# Altium schematic sheet drive_circuit.SchDoc
size 449 x 299 mm; SheetNumber: 2; SheetTotal: 2
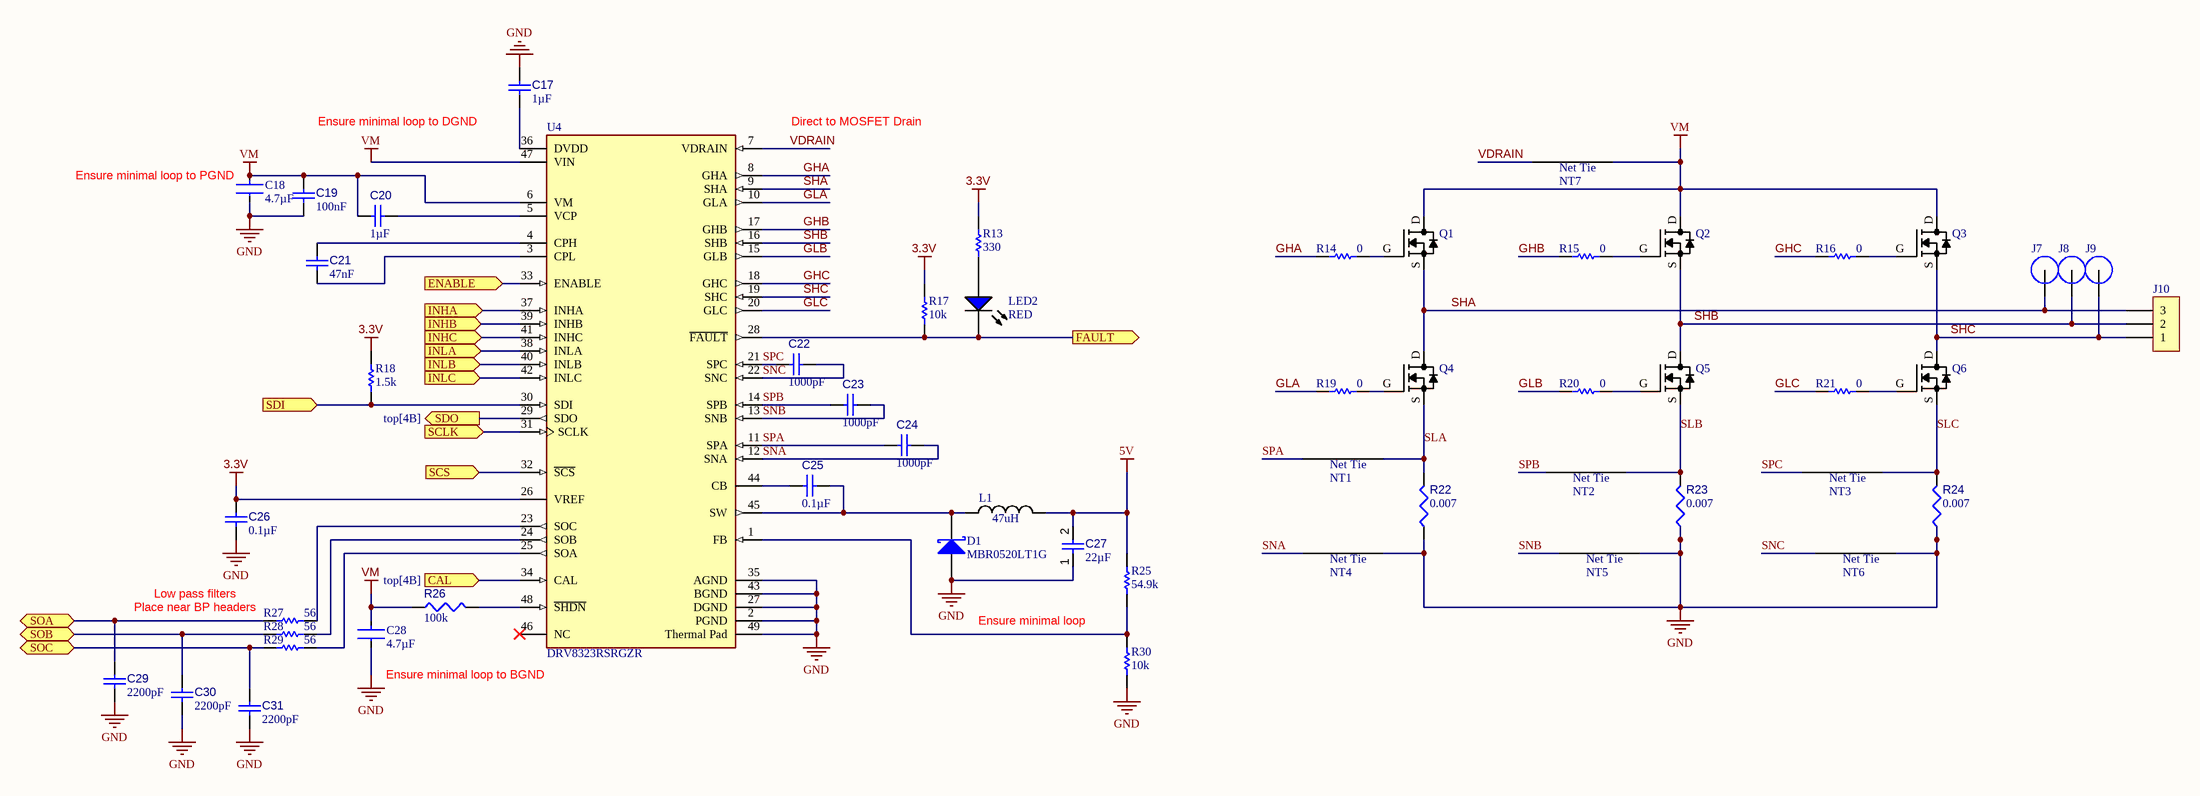
[diagram p0: drive_circuit.SchDoc]

## Parts
C17  value 1µF  [CAPC1608X94X35NL15T15]  (hidden comment: Capacitor 1 uF +/- 10% 16 V 0603)
C18  value 4.7µF  [FP-MK325N-MFG]  (hidden comment: HMK325B7225KN-T)
C19  value 100nF  [CAPC0603(1608)100_L]  (hidden comment: Capacitor 4.7µF +/-20% 10V 0603)
C20  value 1µF  [CAPC1608X94X35NL15T15]  (hidden comment: Capacitor 1 uF +/- 10% 16 V 0603)
C21  value 47nF  [CAPC0603(1608)100_L]  (hidden comment: Capacitor 4.7µF +/-20% 10V 0603)
C22  value 1000pF  [CAPC1608X94X35NL15T15]  (hidden comment: Capacitor 1 uF +/- 10% 16 V 0603)
C23  value 1000pF  [CAPC1608X94X35NL15T15]  (hidden comment: Capacitor 1 uF +/- 10% 16 V 0603)
C24  value 1000pF  [CAPC1608X94X35NL15T15]  (hidden comment: Capacitor 1 uF +/- 10% 16 V 0603)
C25  value 0.1µF  [CAPC1608X94X35NL15T15]  (hidden comment: Capacitor 1 uF +/- 10% 16 V 0603)
C26  value 0.1µF  [CAPC1608X94X35NL15T15]  (hidden comment: Capacitor 1 uF +/- 10% 16 V 0603)
C27  value 22µF  [CAPC3216X180X50NL20T25]  (hidden comment: Capacitor 10 uF +/- 10% 16 V 1206)
C28  value 4.7µF  [FP-MK325N-MFG]  (hidden comment: HMK325B7225KN-T)
C29  value 2200pF  [CAPC1608X94X35NL15T15]  (hidden comment: Capacitor 1 uF +/- 10% 16 V 0603)
C30  value 2200pF  [CAPC1608X94X35NL15T15]  (hidden comment: Capacitor 1 uF +/- 10% 16 V 0603)
C31  value 2200pF  [CAPC1608X94X35NL15T15]  (hidden comment: Capacitor 1 uF +/- 10% 16 V 0603)
D1  MBR0520LT1G  [ONSC-SOD-123-2-425-04_V]
J7  (no value)  [M3 Spade Hole]
J8  (no value)  [M3 Spade Hole]
J9  (no value)  [M3 Spade Hole]
J10  1704936  [1704936]  (value not drawn)
L1  value 47uH  [INDC6060X28N]  (hidden comment: 22uH)
LED2  RED  [VISH-TLMX1100-2_V]
NT1  0.25mm  [NetTie_0.25mm]  (value not drawn)  (net tie, no BOM)
NT2  0.25mm  [NetTie_0.25mm]  (value not drawn)  (net tie, no BOM)
NT3  0.25mm  [NetTie_0.25mm]  (value not drawn)  (net tie, no BOM)
NT4  0.25mm  [NetTie_0.25mm]  (value not drawn)  (net tie, no BOM)
NT5  0.25mm  [NetTie_0.25mm]  (value not drawn)  (net tie, no BOM)
NT6  0.25mm  [NetTie_0.25mm]  (value not drawn)  (net tie, no BOM)
NT7  0.25mm  [NetTie_0.25mm]  (value not drawn)  (net tie, no BOM)
Q1  (no value)  [SO8FL]
Q2  (no value)  [SO8FL]
Q3  (no value)  [SO8FL]
Q4  (no value)  [SO8FL]
Q5  (no value)  [SO8FL]
Q6  (no value)  [SO8FL]
R13  value 330  [RESC1608X55X25ML10T15]  (hidden comment: Resistor 0R +/- 5% 0603 100 mW)
R14  value 0  [RESC1608X55X25ML10T15]  (hidden comment: Resistor 0R +/- 5% 0603 100 mW)
R15  value 0  [RESC1608X55X25ML10T15]  (hidden comment: Resistor 0R +/- 5% 0603 100 mW)
R16  value 0  [RESC1608X55X25ML10T15]  (hidden comment: Resistor 0R +/- 5% 0603 100 mW)
R17  value 10k  [RESC1608X55X25ML10T15]  (hidden comment: Resistor 0R +/- 5% 0603 100 mW)
R18  value 1.5k  [RESC1608X55X25ML10T15]  (hidden comment: Resistor 0R +/- 5% 0603 100 mW)
R19  value 0  [RESC1608X55X25ML10T15]  (hidden comment: Resistor 0R +/- 5% 0603 100 mW)
R20  value 0  [RESC1608X55X25ML10T15]  (hidden comment: Resistor 0R +/- 5% 0603 100 mW)
R21  value 0  [RESC1608X55X25ML10T15]  (hidden comment: Resistor 0R +/- 5% 0603 100 mW)
R22  value 0.007  [FP-RT2512-MFG]  (hidden comment: RT2512BKD071K21L)
R23  value 0.007  [FP-RT2512-MFG]  (hidden comment: RT2512BKD071K21L)
R24  value 0.007  [FP-RT2512-MFG]  (hidden comment: RT2512BKD071K21L)
R25  value 54.9k  [RESC1608X55X25ML10T15]  (hidden comment: Resistor 0R +/- 5% 0603 100 mW)
R26  value 100k  [RESC1608X55X25ML10T15]  (hidden comment: Resistor 100k +/-1% 0603 100 mW)
R27  value 56  [RESC1608X55X25ML10T15]  (hidden comment: Resistor 0R +/- 5% 0603 100 mW)
R28  value 56  [RESC1608X55X25ML10T15]  (hidden comment: Resistor 0R +/- 5% 0603 100 mW)
R29  value 56  [RESC1608X55X25ML10T15]  (hidden comment: Resistor 0R +/- 5% 0603 100 mW)
R30  value 10k  [RESC1608X55X25ML10T15]  (hidden comment: Resistor 0R +/- 5% 0603 100 mW)
U4  DRV8323RSRGZR  [FP-RGZ0048A-IPC_A]

## Ports
CAL (in, see top[4B]), ENABLE (in, see top[4B]), FAULT (out, see top[5B]), INHA (in, see top[4B]), INHB (in, see top[4B]), INHC (in, see top[4B]), INLA (in, see top[4B]), INLB (in, see top[4B]), INLC (in, see top[4B]), SCLK (in, see top[4B]), SCS (in, see top[4B]), SDI (in, see top[4B]), SDO (out, see top[4B]), SOA (bidir, see top[5B]), SOB (bidir, see top[5B]), SOC (bidir, see top[5B])

## Nets
3.3V: C26.2 R13.2 R17.2 R18.2 U4.26(VREF)
5V: C27.2 L1.2 R25.2
GND: C17.2 C18.2 C19.1 C26.1 C27.1 C28.2 C29.1 C30.1 C31.1 D1.1(A) NT4.2 NT5.2 NT6.2 R22.1 R23.1 R24.1 R30.1 U4.2(PGND) U4.27(DGND) U4.35(AGND) U4.43(BGND) U4.49(Thermal_Pad)
VM: C18.1 C19.2 C20.1 C28.1 NT7.2 Q1.D Q2.D Q3.D R26.1 U4.6(VM) U4.47(VIN)
CAL: U4.34(CAL) ; port CAL
ENABLE: U4.33(ENABLE) ; port ENABLE
FAULT: LED2.2(K) R17.1 U4.28(~{FAULT}) ; port FAULT
GHA: R14.2 U4.8(GHA)
GHB: R15.2 U4.17(GHB)
GHC: R16.2 U4.18(GHC)
GLA: R19.2 U4.10(GLA)
GLB: R20.2 U4.15(GLB)
GLC: R21.2 U4.20(GLC)
INHA: U4.37(INHA) ; port INHA
INHB: U4.39(INHB) ; port INHB
INHC: U4.41(INHC) ; port INHC
INLA: U4.38(INLA) ; port INLA
INLB: U4.40(INLB) ; port INLB
INLC: U4.42(INLC) ; port INLC
SCLK: U4.31(SCLK) ; port SCLK
SCS: U4.32(~{SCS}) ; port SCS
SDI: R18.1 U4.30(SDI) ; port SDI
SDO: U4.29(SDO) ; port SDO
SHA: J7.1 J10.3 Q1.S Q4.D U4.9(SHA)
SHB: J8.1 J10.2 Q2.S Q5.D U4.16(SHB)
SHC: J9.1 J10.1 Q3.S Q6.D U4.19(SHC)
SLA: NT1.2 Q4.S R22.2
SLB: NT2.2 Q5.S R23.2
SLC: NT3.2 Q6.S R24.2
SNA: C24.1 NT4.1 U4.12(SNA)
SNB: C23.1 NT5.1 U4.13(SNB)
SNC: C22.1 NT6.1 U4.22(SNC)
SOA: C29.2 R27.2 ; port SOA
SOB: C30.2 R28.2 ; port SOB
SOC: C31.2 R29.2 ; port SOC
SPA: C24.2 NT1.1 U4.11(SPA)
SPB: C23.2 NT2.1 U4.14(SPB)
SPC: C22.2 NT3.1 U4.21(SPC)
VDRAIN: NT7.1 U4.7(VDRAIN)
NetC17_1: C17.1 U4.36(DVDD)
NetC20_2: C20.2 U4.5(VCP)
NetC21_1: C21.1 U4.4(CPH)
NetC21_2: C21.2 U4.3(CPL)
NetC25_1: C25.1 D1.2(K) L1.1 U4.45(SW)
NetC25_2: C25.2 U4.44(CB)
NetLED2_1: LED2.1(A) R13.1
NetQ1_G: Q1.G R14.1
NetQ2_G: Q2.G R15.1
NetQ3_G: Q3.G R16.1
NetQ4_G: Q4.G R19.1
NetQ5_G: Q5.G R20.1
NetQ6_G: Q6.G R21.1
NetR25_1: R25.1 R30.2 U4.1(FB)
NetR26_2: R26.2 U4.48(~{SHDN})
NetR27_1: R27.1 U4.23(SOC)
NetR28_1: R28.1 U4.24(SOB)
NetR29_1: R29.1 U4.25(SOA)

Not connected (* = marked no-connect by the designer): U4 46(NC)*

## Notes on the sheet
- Ensure minimal loop to DGND
- Direct to MOSFET Drain
- (near C18) Ensure minimal loop to PGND
- Low pass filters
- Place near BP headers
- Ensure minimal loop
- Ensure minimal loop to BGND
- (in symbol NetTie_0.25mm) Net Tie

## Library data of the parts
C17 = CMP-001-00003-6: Chip Capacitor, 1 uF, +/- 10%, 6.3 V, 0603 (1608 Metric); Voltage Rating: 16V; Capacitor Type: Ceramic; Max Operating Temperature: 125°C; Pins: 2; Tolerance: 10%; Min Operating Temperature: -55°C; RoHS Compliant: True; Mounting Technology: SM; Case/Package: 0603
C18 C28 = CMP-001-00088-1: Ceramic Capacitor, Multilayer, Ceramic, 100V, 10% +Tol, 10% -Tol, X7R, 15% TC, 2.2uF, Surface Mount, 1210; Capacitor Type: Ceramic; Min Operating Temperature: -55°C; Pins: 2; Case/Package: 1210; Mounting Technology: Surface Mount; Max Operating Temperature: 125°C; RoHS Compliant: Yes
C19 = CMP-001-00076-4: Chip Capacitor, 4.7µF +/-20%, 100V, 0603, Thickness 1 mm; Tolerance: 10%; Mounting Technology: SMT; Case/Package: 0603; Pins: 2; Min Operating Temperature: -55°C; Max Operating Temperature: 85°C; Voltage Rating: 10V
C20 = CMP-001-00003-6: Chip Capacitor, 1 uF, +/- 10%, 16 V, 0603 (1608 Metric); Voltage Rating: 16V; Capacitor Type: Ceramic; Max Operating Temperature: 125°C; Pins: 2; Tolerance: 10%; Min Operating Temperature: -55°C; RoHS Compliant: True; Mounting Technology: SM; Case/Package: 0603
C21 = CMP-001-00076-4: Chip Capacitor, 47nF +/-20%, 100V, 0603, Thickness 1 mm; Tolerance: 10%; Mounting Technology: SMT; Case/Package: 0603; Pins: 2; Min Operating Temperature: -55°C; Max Operating Temperature: 85°C; Voltage Rating: 10V
C22-C26 C29-C31 = CMP-001-00003-6: Chip Capacitor, 0.1uF, +/- 10%, 6.3 V, 0603 (1608 Metric); Voltage Rating: 16V; Capacitor Type: Ceramic; Max Operating Temperature: 125°C; Pins: 2; Tolerance: 10%; Min Operating Temperature: -55°C; RoHS Compliant: True; Mounting Technology: SM; Case/Package: 0603
C27 = CMP-001-00016-6: Chip Capacitor, 22 uF, +/- 10%, 16 V, 1206 (3216 Metric); Capacitor Type: Ceramic; Voltage Rating: 16V; Tolerance: 10%; Min Operating Temperature: -55°C; Pins: 2; Mounting Technology: SM; Case/Package: 1206; Max Operating Temperature: 125°C; RoHS Compliant: True
D1 = CMP-004-00003-2: Schottky Power Rectifier, 20 V, 5.5 A, -65 to 125 degC, 2-Pin SMD, RoHS, Tape and Reel; Manufacturer: ON Semiconductor; Forward Current: 500mA; Peak Reverse Current: 250uA; Elements: 1; Forward Voltage: 385mV; Max Surge Current: 5.5A; Max Operating Temperature: 125°C; Min Operating Temperature: -65°C; Mounting Technology: SM; Datasheet URL: http://www.onsemi.cn/pub_link/Collateral/MBR0520LT1-D.PDF; RoHS Compliant: True; Pins: 2; Package Quantity: 3000; Case/Package: SOD; Package Reference: SOD-123-2-425-04; Package Description: 2-Pin Surface Mount Device, Body 2.69 x 1.6 mm; Packaging: TapeandReel; Manufacturer URL: http://www.onsemi.com/; Datasheet Version: Rev. 6, 01/2012
J7-J9 = M3 Spade Terminal
J10 = 1704936: CONN TERM BLOCK 3POS 7.62MM; Manufacturer: Phoenix Contact; Number of Levels: 1; Positions Per Level: 3; Pitch: 0.300" (7.62mm); Mating Orientation: Horizontal with Board; Current: 30A; Voltage: 300V; Wire Gauge: 10-30 AWG; Wire Termination: Screw - Rising Cage Clamp; Torque - Screw: 0.5-0.6 Nm (4.4-5.3 Lb-In); Screw Thread: M3; Supplier 1: Digi-Key; Supplier Part Number 1: 277-5954-ND; RoHS: RoHS Compliant; Category: Connectors, Interconnects; Stock: 3559; Pricing 1: 1=2.19, 10=2.128, 50=1.989, 100=1.8299, 250=1.69064, 500=1.61108, 1000=1.482 (USD); Packaging: Bulk; Part Status: Active; Mounting Type: Through Hole; Features: Interlocking (Side); Color: Green; Operating Temperature: -; Housing Material: Polyamide (PA), Nylon; Contact Material - Plating: -; Clamp Material - Plating: -; Screw Material - Plating: -; ComponentLink1URL: http://media.digikey.com/PDF/Data%20Sheets/Phoenix%20Contact%20PDFs/1704936.pdf; ComponentLink1Description: http://media.digikey.com/PDF/Data%20Sheets/Phoenix%20Contact%20PDFs/1704936.pdf; Manufacturer Part Number: 1704936
L1 = NR6028T220M: INDUCTOR 47UH 1.4A 175.5 MOHM
LED2 = CMP-007-00028-2: red LED, 10 mA, 2 V, -40 to 100 degC, 2-Pin SMD (0603), RoHS, Tape and Reel; Manufacturer: Vishay Semiconductor; Forward Voltage: 3.9V; Illumination Colour: Blue; Viewing Angle: 160degrees; Power: 68mW; Forward Current: 10mA; Lens Style: Diffused; Luminous Intensity: 5mcd; Case/Package: 0603; Datasheet URL: http://download.siliconexpert.com/pdfs/2016/8/7/12/43/26/667/vsh_/manual/379263299541529tlmb1100.pdf; Datasheet Version: Rev. 2.7, 03/2016; Manufacturer URL: http://www.vishay.com/; Package Reference: 0603; Min Operating Temperature: -40°C; Packaging: TapeandReel; RoHS Compliant: True; Nominal Vf: 3.9V; Mounting Technology: SM; Pins: 2; Package Description: 2-Pin Surface Mount Device, Body 1.6 x 0.8 mm; Colour: Blue; Package Quantity: 3000; Max Operating Temperature: 100°C
NT1-NT7 = NetTie_0.25mm
Q1-Q6 = NTMFS4935NT1G: MOSFET N-CH 30V 13A SO8FL; Manufacturer: ON Semiconductor; FET Type: N-Channel; Current - Continuous Drain (Id) @ 25°C: 13A (Ta), 93A (Tc); Drive Voltage (Max Rds On,  Min Rds On): 4.5V, 10V; Vgs(th) (Max) @ Id: 2.2V @ 250µA; Gate Charge (Qg) (Max) @ Vgs: 49.4nC @ 10V; Input Capacitance (Ciss) (Max) @ Vds: 4850pF @ 15V; Vgs (Max): ±20V; Power Dissipation (Max): 930mW (Ta), 48W (Tc); Rds On (Max) @ Id, Vgs: 3.2 mOhm @ 30A, 10V; Supplier 1: Digi-Key; Supplier Part Number 1: NTMFS4935NT1GOSCT-ND; RoHS: RoHS Compliant; Category: Discrete Semiconductor Products; Stock 1: 932; Pricing 1: 1=0.61, 10=0.541, 100=0.4145, 500=0.3277 (USD); Packaging: Cut Tape (CT); Part Status: Active; Technology: MOSFET (Metal Oxide); Drain to Source Voltage (Vdss): 30V; FET Feature: -; Operating Temperature: -55°C ~ 150°C (TJ); Mounting Type: Surface Mount; Supplier Device Package: 5-DFN (5x6) (8-SOFL); Package / Case: 8-PowerTDFN, 5 Leads; ComponentLink1URL: http://www.onsemi.com/pub_link/Collateral/NTMFS4935N-D.PDF; ComponentLink1Description: http://www.onsemi.com/pub_link/Collateral/NTMFS4935N-D.PDF; Manufacturer Part Number: NTMFS4935NT1G
R13 = CMP-009-00006-5: Chip Resistor, 330 Ohm, 0.1 W, -55 to 155 degC, 0603 (1608 Metric); Power: 100mW; Voltage Rating: 50V; Max Operating Temperature: 155°C; RoHS Compliant: True; Mounting Technology: SM; Case/Package: 0603; Min Operating Temperature: -55°C; Tolerance: 5%; Pins: 2
R14-R17 R19-R21 R25 R27-R30 = CMP-009-00006-5: Chip Resistor, 10k Ohm, 0.1 W, -55 to 155 degC, 0603 (1608 Metric); Power: 100mW; Voltage Rating: 50V; Max Operating Temperature: 155°C; RoHS Compliant: True; Mounting Technology: SM; Case/Package: 0603; Min Operating Temperature: -55°C; Tolerance: 5%; Pins: 2
R18 = CMP-009-00006-5: Chip Resistor, 1.5k Ohm, 0.1 W, -55 to 155 degC, 0603 (1608 Metric); Power: 100mW; Voltage Rating: 50V; Max Operating Temperature: 155°C; RoHS Compliant: True; Mounting Technology: SM; Case/Package: 0603; Min Operating Temperature: -55°C; Tolerance: 5%; Pins: 2
R22-R24 = CMP-009-00179-1: Fixed Resistor, Thin Film, 0.75W, 1210ohm, 200V, 0.1% +/-Tol, 25ppm/Cel, Surface Mount, 2512; Power: 750mW; Case/Package: 2512; RoHS Compliant: Yes; Mounting Technology: Surface Mount; Max Operating Temperature: 125°C; Pins: 2; Tolerance: 0.1%; Min Operating Temperature: -55°C
R26 = CMP-009-00023-5: Chip Resistor, 100 KOhm, +/- 1%, 0.1 W, -55 to 155 degC, 0603 (1608 Metric); Voltage Rating: 50V; Power: 100mW; Max Operating Temperature: 155°C; RoHS Compliant: True; Tolerance: 1%; Pins: 2; Case/Package: 0603; Mounting Technology: SM; Min Operating Temperature: -55°C
U4 = CMP-00024-00006-1: Brushless DC Motor Controller, 0.005A, PQCC48; RoHS Compliant: Yes